# Altium schematic sheet NU1680 Rx_EVM_SCH_Ver.2.SchDoc
size A4
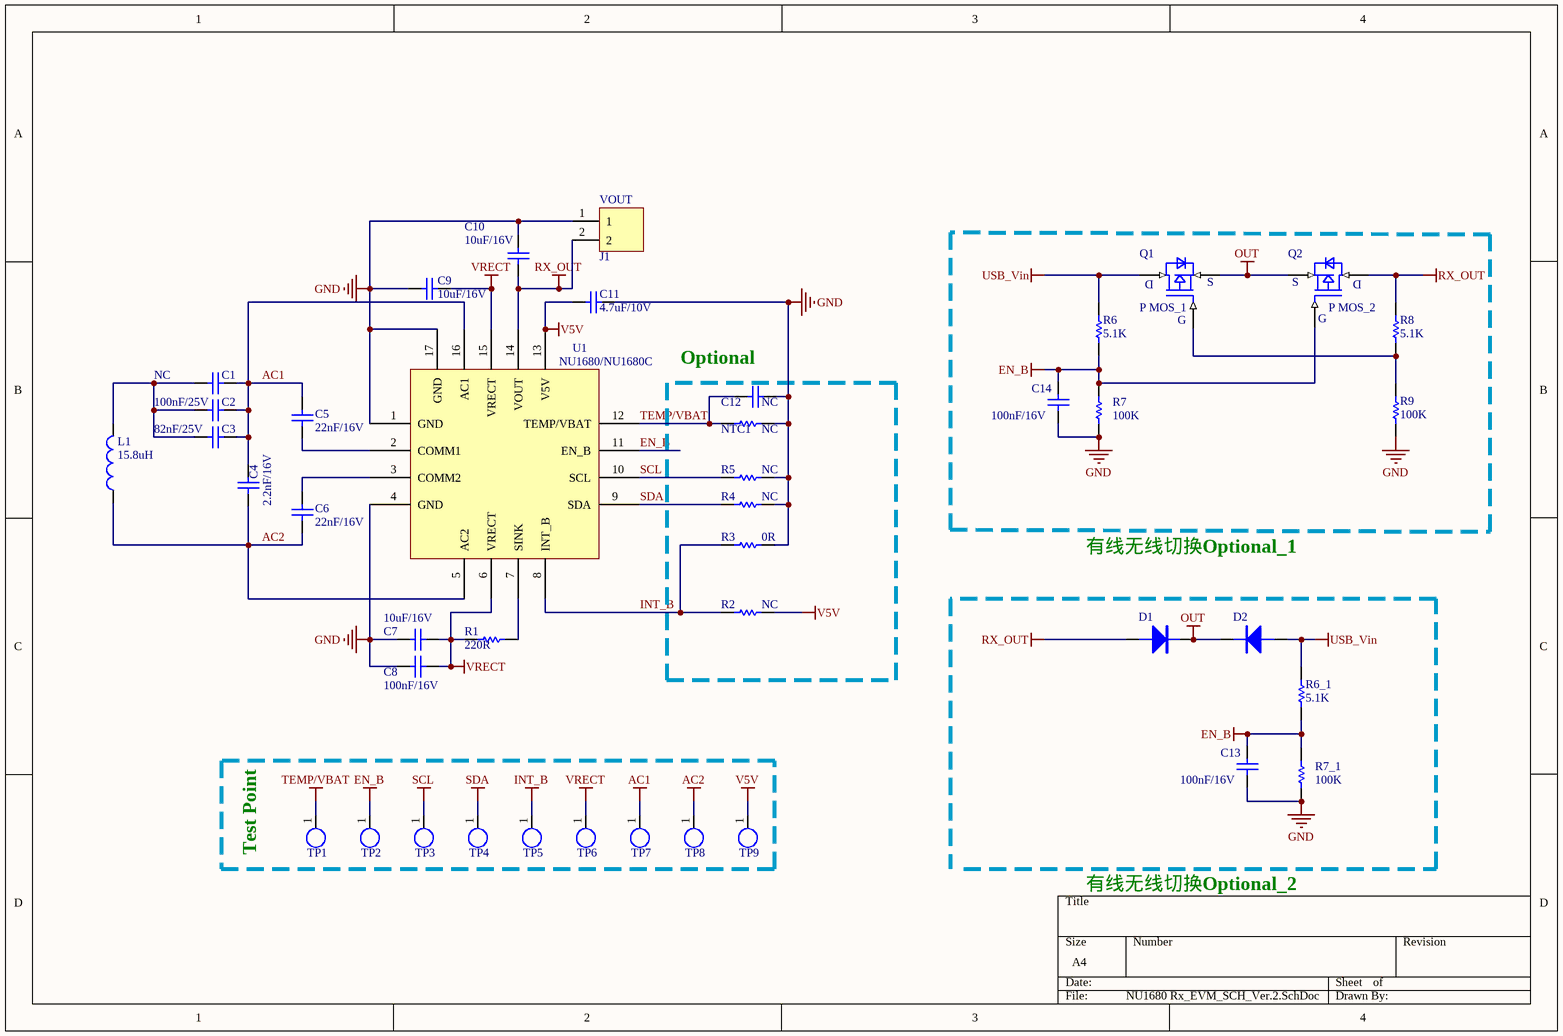
[diagram p0: NU1680 Rx_EVM_SCH_Ver.2.SchDoc]

## Parts
C1  NC  [SMD_R5_CAP_0402]
C2  100nF/25V  [SMD_R5_CAP_0402]
C3  82nF/25V  [SMD_R5_CAP_0402]
C4  2.2nF/16V  [SMD_R5_CAP_0402]
C5  22nF/16V  [SMD_R5_CAP_0402]
C6  22nF/16V  [SMD_R5_CAP_0402]
C7  10uF/16V  [SMD_R5_CAP_0603]
C8  100nF/16V  [SMD_R5_CAP_0402]
C9  10uF/16V  [SMD_R5_CAP_0603]
C10  10uF/16V  [SMD_R5_CAP_0603]
C11  4.7uF/10V  [SMD_R5_CAP_0603]
C12  NC  [SMD_R5_CAP_0402]
C13  100nF/16V  [SMD_R5_CAP_0402]
C14  100nF/16V  [SMD_R5_CAP_0402]
D1  (no value)  [DO-201AD(V)]
D2  (no value)  [DO-201AD(V)]
L1  15.8uH  [HDR1X2]
NTC1  NC  [SMD_R5_RES_0402]
Q1  P MOS_1
Q2  P MOS_2
R1  220R  [SMD_R5_RES_0805]
R2  NC  [SMD_R5_RES_0402]
R3  0R  [SMD_R5_RES_0402]
R4  NC  [SMD_R5_RES_0402]
R5  NC  [SMD_R5_RES_0402]
R6  value 5.1K  [IR0402(R)]  (hidden comment: 1.8K/5%/0402)
R6_1  value 5.1K  [IR0402(R)]  (hidden comment: 1.8K/5%/0402)
R7  value 100K  [IR0402(R)]  (hidden comment: 1.8K/5%/0402)
R7_1  value 100K  [IR0402(R)]  (hidden comment: 1.8K/5%/0402)
R8  value 5.1K  [IR0402(R)]  (hidden comment: 1.8K/5%/0402)
R9  value 100K  [IR0402(R)]  (hidden comment: 1.8K/5%/0402)
TP1  (no value)  [SMD_R5_Testpoint_1.5mm]
TP2  (no value)  [SMD_R5_Testpoint_1.5mm]
TP3  (no value)  [SMD_R5_Testpoint_1.5mm]
TP4  (no value)  [SMD_R5_Testpoint_1.5mm]
TP5  (no value)  [SMD_R5_Testpoint_1.5mm]
TP6  (no value)  [SMD_R5_Testpoint_1.5mm]
TP7  (no value)  [SMD_R5_Testpoint_1.5mm]
TP8  (no value)  [SMD_R5_Testpoint_1.5mm]
TP9  (no value)  [SMD_R5_Testpoint_1.5mm]
U1  NU1680/NU1680C  [NU1680_QFN16]
VOUT  J1

## Blocks framed on the sheet
Optional: C12 NTC1 R2-R5
Test Point: TP1-TP9

## Nets
AC1: C1.2 C2.2 C3.2 C4.2 C5.1 TP7.1 U1.16(AC1)
AC2: C4.1 C6.1 L1.1 TP8.1 U1.5(AC2)
EN_B: C13.1 C14.1 Q2.1(G) R6.1 R6_1.1 R7.2 R7_1.2 TP2.1 U1.11(EN_B)
GND: C7.2 C8.2 C9.2 C10.2 C11.2 C12.1 C13.2 C14.2 NTC1.1 R3.2 R4.1 R5.1 R7.1 R7_1.1 R9.2 U1.1(GND) U1.4(GND) U1.17(GND) VOUT.1
INT_B: R2.1 R3.1 TP5.1 U1.8(INT_B)
OUT: D1.2(K) D2.2(K) Q1.3(S) Q2.2(D)
RX_OUT: C10.1 D1.1(A) Q2.3(S) R8.1 U1.14(VOUT) VOUT.2
SCL: R5.2 TP3.1 U1.10(SCL)
SDA: R4.2 TP4.1 U1.9(SDA)
TEMP/VBAT: C12.2 NTC1.2 TP1.1 U1.12(TEMP/VBAT)
USB_Vin: D2.1(A) Q1.2(D) R6.2 R6_1.2
V5V: C11.1 R2.2 TP9.1 U1.13(V5V)
VRECT: C7.1 C8.1 C9.1 R1.2 TP6.1 U1.6(VRECT) U1.15(VRECT)
NetC1_1: C1.1 C2.1 C3.1 L1.2
NetC5_2: C5.2 U1.2(COMM1)
NetC6_2: C6.2 U1.3(COMM2)
NetQ1_1: Q1.1(G) R8.2 R9.1
NetR1_1: R1.1 U1.7(SINK)

## Notes on the sheet
- 有线无线切换Optional_1
- 有线无线切换Optional_2

## Library data of the parts
C1-C6 C8 C12-C14 = cap: 0402; Value: *
C7 C9-C11 = cap: 0603; Value: *
D1 D2 = DIODE
L1 = Inductor
NTC1 R2-R5 = Res1: 0402
R1 = Res1: 0805
R6 R6_1 R7 R7_1 R8 R9 = Res1: RES 1.8Kohm 1/16W 1% 0402; Published: 8-Jun-2000; LatestRevisionDate: 17-Jul-2002; LatestRevisionNote: Re-released for DXP Platform.; PackageReference: AXIAL-0.3; Publisher: Altium Limited
TP1-TP9 = Testpoint
U1 = NU1680
VOUT = CONNECT2X1